# Altium project GPS_Traking_V1_1.PrjPcb
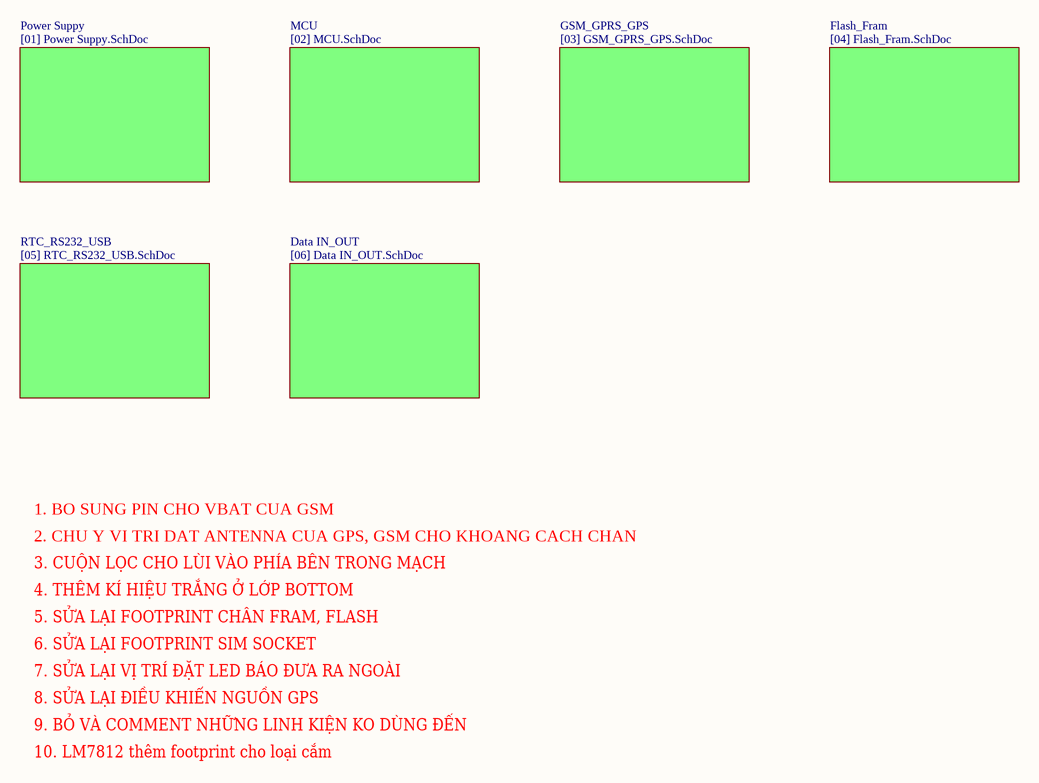
[diagram p0: GPS_Traking_V1_1.SchDoc]
7 sheets, 166 parts. Net scope: flat (ports and power ports of the same name join across sheets).
Board file: GPS_Traking_V1_1.PcbDoc
Sheets:
  GPS_Traking_V1_1.SchDoc
    Power Suppy = [01] Power Suppy.SchDoc
    MCU = [02] MCU.SchDoc
    GSM_GPRS_GPS = [03] GSM_GPRS_GPS.SchDoc
    Flash_Fram = [04] Flash_Fram.SchDoc
    RTC_RS232_USB = [05] RTC_RS232_USB.SchDoc
    Data IN_OUT = [06] Data IN_OUT.SchDoc

## Sheet GPS_Traking_V1_1.SchDoc: GPS_Tracking
size A4

### Sub-sheets
Data IN_OUT = [06] Data IN_OUT.SchDoc: no entries
Flash_Fram = [04] Flash_Fram.SchDoc: no entries
GSM_GPRS_GPS = [03] GSM_GPRS_GPS.SchDoc: no entries
MCU = [02] MCU.SchDoc: no entries
Power Suppy = [01] Power Suppy.SchDoc: no entries
RTC_RS232_USB = [05] RTC_RS232_USB.SchDoc: no entries

### Notes on the sheet
- 1. BO SUNG PIN CHO VBAT CUA GSM
- 2. CHU Y VI TRI DAT ANTENNA CUA GPS, GSM CHO KHOANG CACH CHAN
- 3. CUỘN LỌC CHO LÙI VÀO PHÍA BÊN TRONG MẠCH
- 4. THÊM KÍ HIỆU TRẮNG Ở LỚP BOTTOM
- 5. SỬA LẠI FOOTPRINT CHÂN FRAM, FLASH
- 6. SỬA LẠI FOOTPRINT SIM SOCKET
- 7. SỬA LẠI VỊ TRÍ ĐẶT LED BÁO ĐƯA RA NGOÀI
- 8. SỬA LẠI ĐIỀU KHIỂN NGUỒN GPS
- 9. BỎ VÀ COMMENT NHỮNG LINH KIỆN KO DÙNG ĐẾN
- 10. LM7812 thêm footprint cho loại cắm
- Title
- Size:
- Date:
- A4
- Number:
- Time:
- Revision:
- Sheet
- of
- File:

## Sheet [01] Power Suppy.SchDoc: Power Supply
size A4
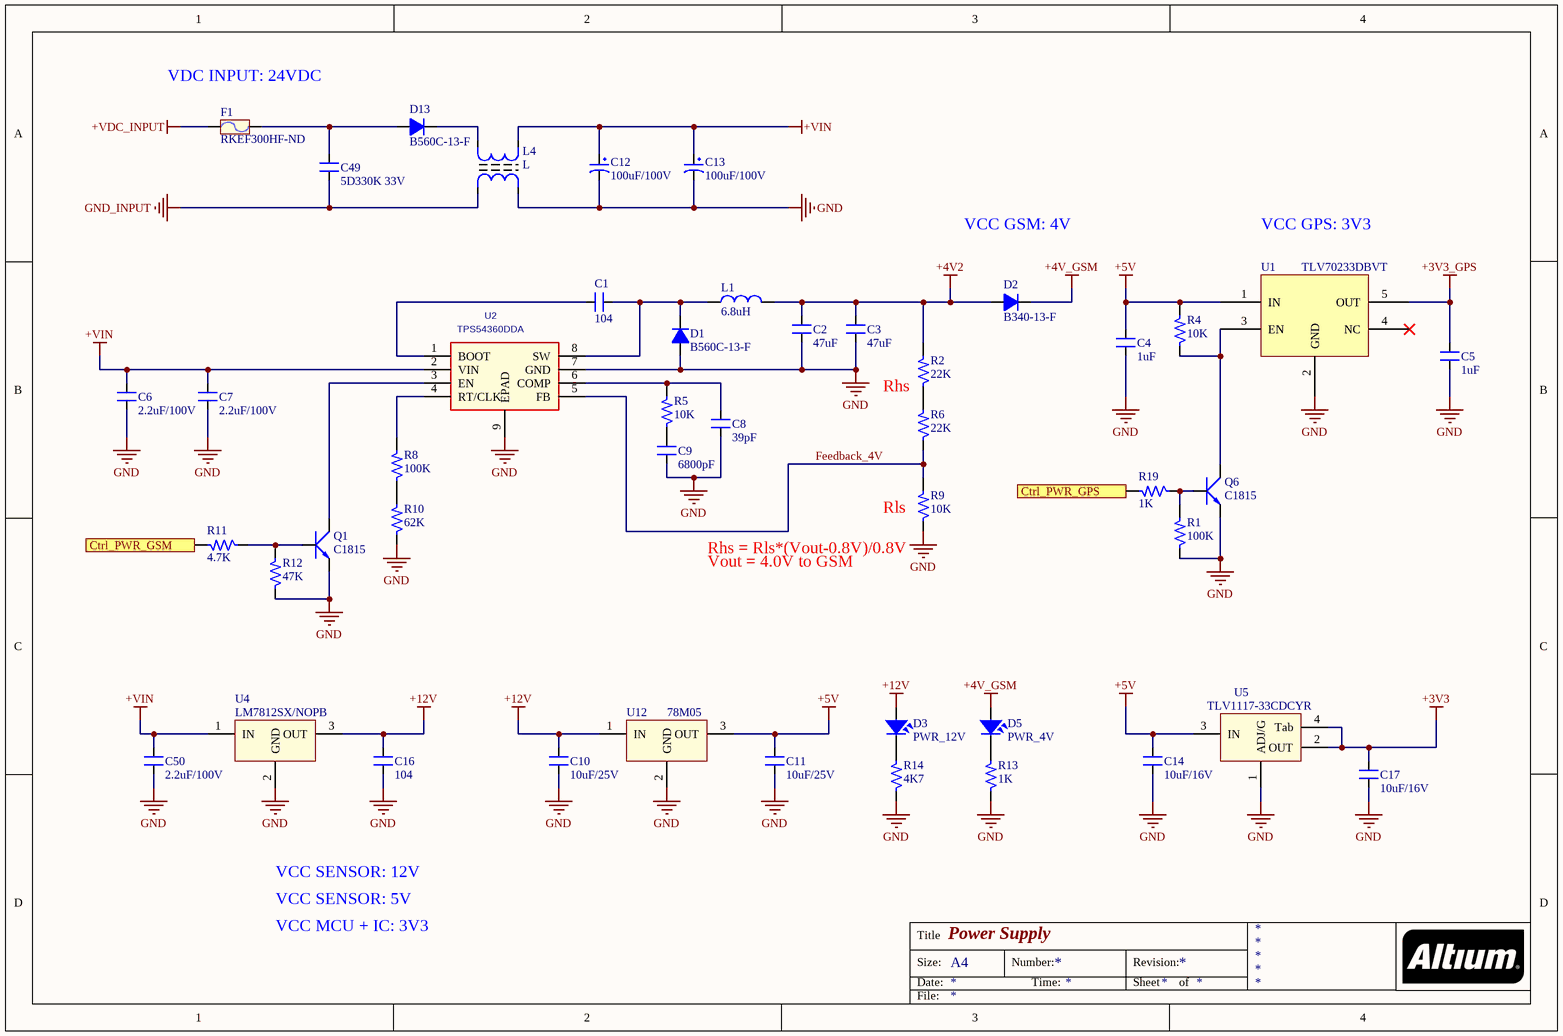
[diagram p1: [01] Power Suppy.SchDoc]

### Parts
C1  104  [C0603 SMT]
C2  47uF  [SM-1210]
C3  47uF  [SM-1210]
C4  1uF  [C0603 SMT]
C5  1uF  [C0603 SMT]
C6  2.2uF/100V  [SM-1210]
C7  2.2uF/100V  [SM-1210]
C8  39pF  [C0603 SMT]
C9  6800pF  [C0603 SMT]
C10  10uF/25V  [C0603 SMT]
C11  10uF/25V  [C0603 SMT]
C12  100uF/100V  [CP1.5/3.4]
C13  100uF/100V  [CP1.5/3.4]
C14  10uF/16V  [C0603 SMT]
C16  104  [C0603 SMT]
C17  10uF/16V  [C0603 SMT]
C49  5D330K 33V  [CN2]
C50  2.2uF/100V  [SM-1210]
D1  B560C-13-F  [DO-214AB SMC]
D2  B340-13-F  [DO-214AB SMA]
D3  PWR_12V  [Led_0603_Yellow]
D5  PWR_4V  [Led_0603_Green]
D13  B560C-13-F  [DO-214AB SMC]
F1  RKEF300HF-ND  [FUSE2]
L1  6.8uH  [L01 SMD 12*12*6]
L4  L  [L2 UF9.8]
Q1  C1815  [SOT23B]
Q6  C1815  [SOT23B]
R1  100K  [R0603 -SMT]
R2  22K  [R0603 -SMT]
R4  10K  [R0603 -SMT]
R5  10K  [R0603 -SMT]
R6  22K  [R0603 -SMT]
R8  100K  [R0603 -SMT]
R9  10K  [R0603 -SMT]
R10  62K  [R0603 -SMT]
R11  4.7K  [R0603 -SMT]
R12  47K  [R0603 -SMT]
R13  1K  [R0603 -SMT]
R14  4K7  [R0603 -SMT]
R19  1K  [R0603 -SMT]
U1  TLV70233DBVT  [TLV70233_3.3V]
U2  TPS54360DDA  [DDA8_3P1X2P4-M]
U4  LM7812SX/NOPB  [TO-263-4]
U5  TLV1117-33CDCYR  [SOT223-4N]
U12  78M05  [TO252-3L]

### Ports
Ctrl_PWR_GPS, Ctrl_PWR_GSM

### Nets
+3V3: C17.2 U5.2(OUT) U5.4(Tab)
+3V3_GPS: C5.2 U1.5(OUT)
+4V2: C2.2 C3.2 D2.1(A) L1.2 R2.2
+4V_GSM: D2.2(K) D5.1
+5V: C4.2 C11.2 C14.2 R4.2 U1.1(IN) U5.3(IN) U12.3(OUT)
+12V: C10.2 C16.2 D3.1 U4.3(OUT) U12.1(IN)
+VDC_INPUT: F1.1
+VIN: C6.2 C7.2 C12.1 C13.1 C50.2 L4.3 U2.2(VIN) U4.1(IN)
GND: C2.1 C3.1 C4.1 C5.1 C6.1 C7.1 C8.1 C9.1 C10.1 C11.1 C12.2 C13.2 C14.1 C16.1 C17.1 C50.1 D1.1(A) L4.2 Q1.1(E) Q6.1(E) R1.1 R9.1 R10.1 R12.1 R13.1 R14.1 U1.2(GND) U2.7(GND) U2.9(EPAD) U4.2(GND) U5.1(ADJ/G) U12.2(GND)
GND_INPUT: C49.1 L4.1
Feedback_4V: R6.1 R9.2 U2.5(FB)
NetC1_1: C1.1 U2.1(BOOT)
NetC1_2: C1.2 D1.2(K) L1.1 U2.8(SW)
NetC8_2: C8.2 R5.2 U2.6(COMP)
NetC9_2: C9.2 R5.1
NetC49_2: C49.2 D13.1(A) F1.2
NetD3_2: D3.2 R14.2
NetD5_2: D5.2 R13.2
NetD13_2: D13.2(K) L4.4
NetQ1_2: Q1.2(C) U2.3(EN)
NetQ1_3: Q1.3(B) R11.1 R12.2
NetQ6_2: Q6.2(C) R4.1 U1.3(EN)
NetQ6_3: Q6.3(B) R1.2 R19.1
NetR2_1: R2.1 R6.2
NetR8_1: R8.1 R10.2
NetR8_2: R8.2 U2.4(RT/CLK)
NetR11_2: R11.2 ; port Ctrl_PWR_GSM
NetR19_2: R19.2 ; port Ctrl_PWR_GPS

Not connected (* = marked no-connect by the designer): U1 4(NC)*

### Notes on the sheet
- (near F1) VDC INPUT: 24VDC
- VCC GSM: 4V
- VCC GPS: 3V3
- Rhs
- (near R9) Rls
- (near R9) Rhs = Rls*(Vout-0.8V)/0.8V
- Vout = 4.0V to GSM
- VCC SENSOR: 12V
- VCC SENSOR: 5V
- VCC MCU + IC: 3V3
- Title
- Size:
- Date:
- A4
- Number:
- Time:
- Revision:
- Sheet
- of
- File:

### Library data of the parts
C1 C4 C5 C8-C11 C14 C16 C17 = CM: Cap SMD; Value: 103
C2 = CM: CAP CER 47UF 10V X5R 1210; Value: 103
C3 = CM: CAP CER 47UF 10V X5R 1210 1276-3380-2-ND; Value: 103
C6 C7 C50 = CM: CAP CER 2.2UF 100V X7R 1210  445-4498-2-ND; Value: 103
C12 C13 = CP4: Cap 1000uF/16V - 220uF/50V; Description 5: 4,7uF>10uF/250V_3,3uF>10uF/400V - 2,2uF>4,7uF/450V; Description 1: 2200uF-3300uF/6,3V - 1000uF-2200uF/10V; Description 2: 1000uF/16V - 470uF => 1000uF/25V - 100uF/100V; Description 3: 330uF>470uF/35V_220uF>470uF/50V_10uF>22uF/250V; Description 4: 220uF => 330uF/63V - 10uF =>33uF/160 - 200V; Value: 1000uF/16V
C49 = CN: Value: 0,1uF/300V; Designed by: VanDungEvn
D1 D13 = D5A: DIODE SCHOTTKY 60V 5A SMC; Value: 1N5408
D2 = D1A: DIODE SCHOTTKY 40V 3A SMC; Value: 1N4007
D3 D5 = LED: LED Single colour Green and Red; Value: LED 3 ly Single Colour
F1 = Fuse: PTC RESET FUSE 60V 3A RADIAL; Designed by: VanDungEvn; Value: Fuse
L1 = L1: FIXED IND 6.2UH 5.7A 22.4 MOHM; Value: 150 mH
L4 = L2x220: Inductor; Value: Loc 220; Designed by: VanDungEvn
Q1 Q6 = C1815: NPN 600mW, ECB; Value: C1815
R1 R2 R4-R6 R8-R12 R14 = RM: Resistor SMD; Value: 1K
R13 R19 = RM: Resistor SMD; Value: 1K
U1 = TLV70233_3.3V
U2 = TPS54360DDA: REG BUCK SPLIT RAIL 8SOPWRPAD; C: Copyright (C) 2015 Accelerated Designs. All rights reserved; Vendor: TEXAS INSTRUMENTS; Built_By: EMA_UL_Team; Value: TPS54360DDA; Manufacturer_Part_Number: TPS54360DDA
U4 = LM78xx: Value: LM7805
U5 = LM1117: 3v3; Value: LM317
U12 = LM78xx: On ap +, from + 5 to + 24VDC; Value: LM7805

## Sheet [02] MCU.SchDoc: MCU
size A4
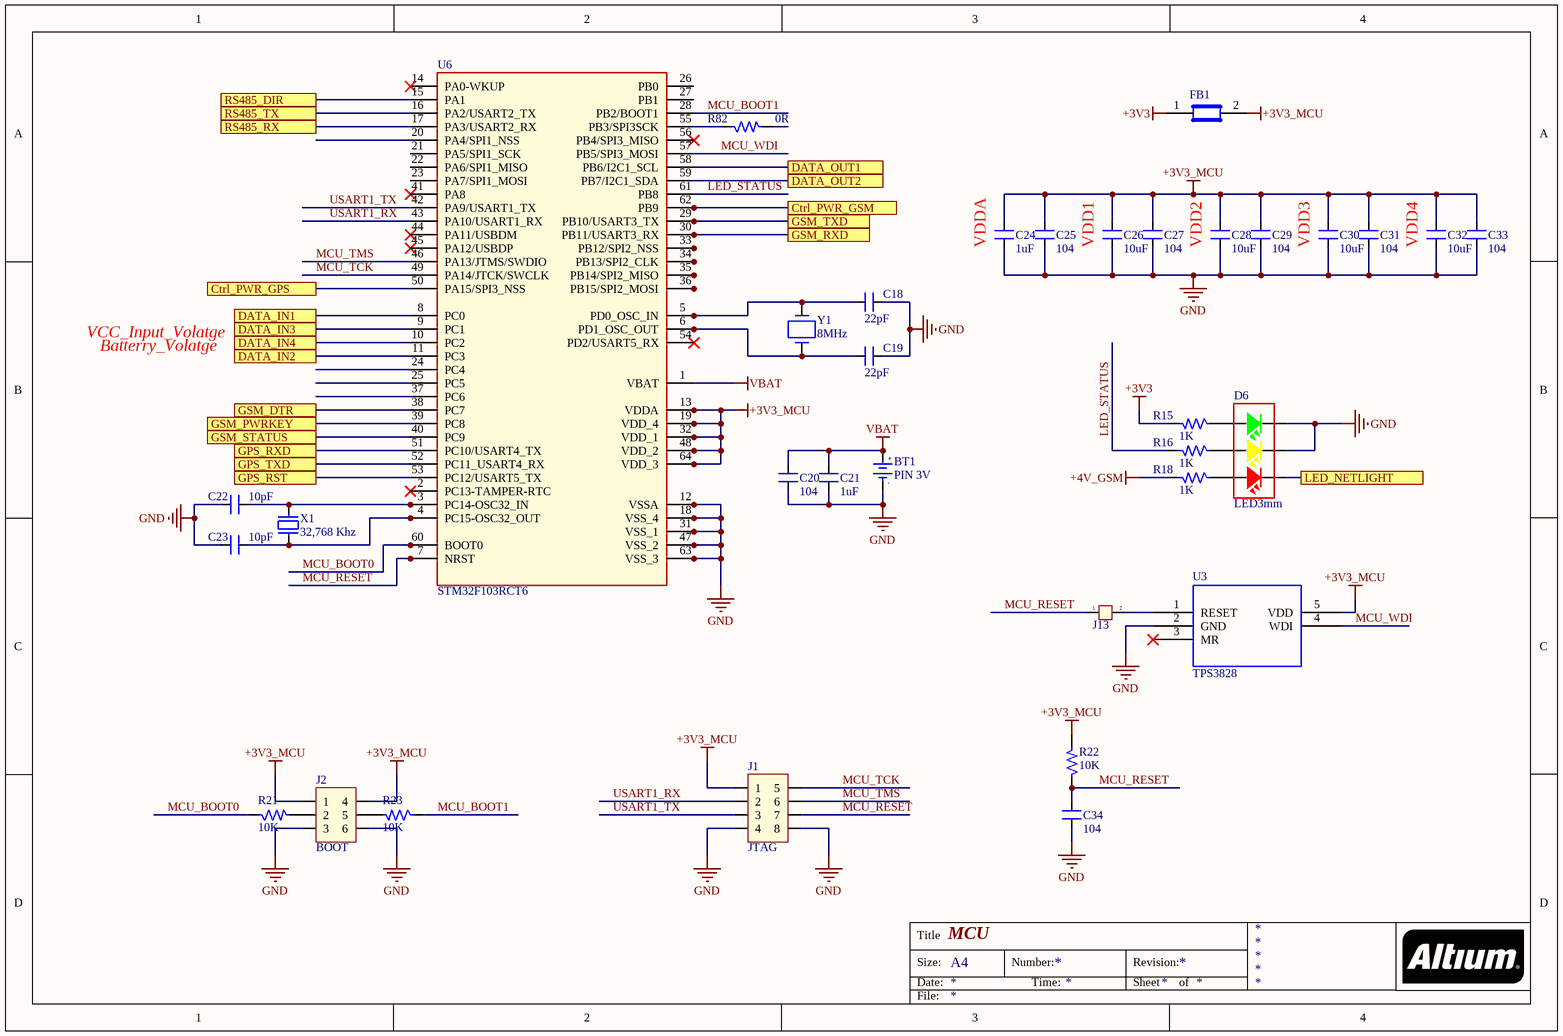
[diagram p2: [02] MCU.SchDoc]

### Parts
BT1  PIN 3V  [PIN3V_mini]
C18  22pF  [C0603 SMT]
C19  22pF  [C0603 SMT]
C20  104  [C0603 SMT]
C21  1uF  [C0603 SMT]
C22  10pF  [C0603 SMT]
C23  10pF  [C0603 SMT]
C24  1uF  [C0603 SMT]
C25  104  [C0603 SMT]
C26  10uF  [C0603 SMT]
C27  104  [C0603 SMT]
C28  10uF  [C0603 SMT]
C29  104  [C0603 SMT]
C30  10uF  [C0603 SMT]
C31  104  [C0603 SMT]
C32  10uF  [C0603 SMT]
C33  104  [C0603 SMT]
C34  104  [C0603 SMT]
D6  LED3mm  [LED 3 holder 3mm]
FB1  BLM21PG600SN1D  [R0805]  (value not drawn)
J1  JTAG  [JP4x2]
J2  BOOT  [JP3x2]
J13  watdog  [JP2]  (value not drawn)
R15  1K  [R0603 -SMT]
R16  1K  [R0603 -SMT]
R18  1K  [R0603 -SMT]
R21  10K  [R0603 -SMT]
R22  10K  [R0603 -SMT]
R23  10K  [R0603 -SMT]
R82  0R  [R0603 -SMT]
U3  TPS3828  [TPS3828]
U6  STM32F103RCT6  [LQFP-64]
X1  32,768 Khz  [XT32kn]
Y1  8MHz  [ABM7_v1_1_BIG]

### Ports
Ctrl_PWR_GPS, Ctrl_PWR_GSM, DATA_IN1, DATA_IN2, DATA_IN3, DATA_IN4, DATA_OUT1, DATA_OUT2, GPS_RST, GPS_RXD, GPS_TXD, GSM_DTR, GSM_PWRKEY, GSM_RXD, GSM_STATUS, GSM_TXD, LED_NETLIGHT, RS485_DIR, RS485_RX, RS485_TX

### Nets
+3V3: FB1.1 R15.2
+3V3_MCU: C24.2 C25.2 C26.2 C27.2 C28.2 C29.2 C30.2 C31.2 C32.2 C33.2 FB1.2 J1.1 J2.1 J2.4 R22.2 U3.5(VDD) U6.13(VDDA) U6.19(VDD_4) U6.32(VDD_1) U6.48(VDD_2) U6.64(VDD_3)
+4V_GSM: R18.2
GND: BT1.2(GND) C18.2 C19.2 C20.1 C21.1 C22.2 C23.2 C24.1 C25.1 C26.1 C27.1 C28.1 C29.1 C30.1 C31.1 C32.1 C33.1 C34.2 D6.3 D6.5 J1.4 J1.8 J2.3 J2.6 U3.2(GND) U6.12(VSSA) U6.18(VSS_4) U6.31(VSS_1) U6.47(VSS_2) U6.63(VSS_3)
VBAT: BT1.1(+3V) C20.2 C21.2 U6.1(VBAT)
LED_STATUS: R16.2 U6.61(PB8)
MCU_BOOT0: R21.1 U6.60(BOOT0)
MCU_BOOT1: R23.1 U6.28(PB2/BOOT1)
MCU_RESET: C34.1 J1.7 J13.1 R22.1 U6.7(NRST)
MCU_TCK: J1.5 U6.49(PA14/JTCK/SWCLK)
MCU_TMS: J1.6 U6.46(PA13/JTMS/SWDIO)
MCU_WDI: U3.4(WDI) U6.57(PB5/SPI3_MOSI)
RS485_DIR: U6.15(PA1) ; port RS485_DIR
RS485_RX: U6.17(PA3/USART2_RX) ; port RS485_RX
RS485_TX: U6.16(PA2/USART2_TX) ; port RS485_TX
USART1_RX: J1.2 U6.43(PA10/USART1_RX)
USART1_TX: J1.3 U6.42(PA9/USART1_TX)
NetC18_1: C18.1 U6.5(PD0_OSC_IN) Y1.2
NetC19_1: C19.1 U6.6(PD1_OSC_OUT) Y1.1
NetC22_1: C22.1 U6.3(PC14-OSC32_IN) X1.1
NetC23_1: C23.1 U6.4(PC15-OSC32_OUT) X1.2
NetD6_1: D6.1 ; port LED_NETLIGHT
NetD6_2: D6.2 R18.1
NetD6_4: D6.4 R16.1
NetD6_6: D6.6 R15.1
NetJ2_2: J2.2 R21.2
NetJ2_5: J2.5 R23.2
NetJ13_2: J13.2 U3.1(RESET)
NetR11_2: U6.62(PB9) ; port Ctrl_PWR_GSM
NetR19_2: U6.50(PA15/SPI3_NSS) ; port Ctrl_PWR_GPS
NetR24_1: U6.39(PC8) ; port GSM_PWRKEY
NetR26_1: U6.38(PC7) ; port GSM_DTR
NetR28_1: U6.30(PB11/USART3_RX) ; port GSM_RXD
NetR29_1: U6.29(PB10/USART3_TX) ; port GSM_TXD
NetR33_1: U6.53(PC12/USART5_TX) ; port GPS_RST
NetR39_2: U6.40(PC9) ; port GSM_STATUS
NetR65_1: U6.8(PC0) ; port DATA_IN1
NetR67_1: U6.58(PB6/I2C1_SCL) ; port DATA_OUT1
NetR68_1: U6.59(PB7/I2C1_SDA) ; port DATA_OUT2
NetR69_1: U6.11(PC3) ; port DATA_IN2
NetR71_1: U6.9(PC1) ; port DATA_IN3
NetR73_1: U6.10(PC2) ; port DATA_IN4
NetR82_1: R82.1 U6.55(PB3/SPI3SCK)
NetU6_51: U6.51(PC10/USART4_TX) ; port GPS_RXD
NetU6_52: U6.52(PC11_USART4_RX) ; port GPS_TXD

Not connected (* = marked no-connect by the designer): R82 2; U3 3(MR)*; U6 2(PC13-TAMPER-RTC)* 14(PA0-WKUP)* 20(PA4/SPI1_NSS) 21(PA5/SPI1_SCK) 22(PA6/SPI1_MISO) 23(PA7/SPI1_MOSI) 24(PC4) 25(PC5) 26(PB0) 27(PB1) 33(PB12/SPI2_NSS) 34(PB13/SPI2_CLK) 35(PB14/SPI2_MISO) 36(PB15/SPI2_MOSI) 37(PC6) 41(PA8)* 44(PA11/USBDM)* 45(PA12/USBDP)* 54(PD2/USART5_RX)* 56(PB4/SPI3_MISO)*

### Notes on the sheet
- (near C24) VDDA
- (near C26) VDD1
- (near C28) VDD2
- (near C30) VDD3
- (near C32) VDD4
- VCC_Input_Volatge
- Batterry_Volatge
- Title
- Size:
- Date:
- A4
- Number:
- Time:
- Revision:
- Sheet
- of
- File:
- (in symbol PIN 3V) +; -

### Library data of the parts
BT1 = PIN 3V: Battery 3VDC; Value: PIN 3V
C18-C34 = CM: Cap SMD; Value: 103
D6 = LED3Holder_3: LED 3 holder RGB 3mm; Value: LED 3 ly Single Colour
FB1 = Ferrite Bead
J1 = JP4x2: Connector 4x2; Value: Connector 4x2
J2 = JP3x2: Connector 3x2; Value: Connector 3x2
J13 = JP 2: Jumper 2; Value: JP 2
R15 R16 R18 = RM: Resistor SMD; Value: 1K
R21-R23 R82 = RM: Resistor SMD; Value: 1K
U6 = STM32F103RCT6: MCU 32BIT 256KB FLASH 64LQFP
X1 = XT32k: Crystal 32,768kHz for timer real; Value: 32,768khz
Y1 = ABM7-16.000MHZ-D2Y-T: CRYSTAL 16MHZ 18PF SMD; Manufacturer: Abracon LLC; Frequency Stability: ±30ppm; Frequency Tolerance: ±20ppm; ESR (Equivalent Series Resistance): 50 Ohm; Operating Mode: Fundamental; .Creator: MM; .Checked PCB: RF; Supplier 1: Digi-Key; Manufacturer Part Number: ABM7-16.000MHZ-D2Y-T; RoHS: RoHS Compliant; Category: Crystals and Oscillators; Stock 1: 5861; Pricing 1: 1=0.96, 10=0.847, 50=0.791, 100=0.7, 500=0.6615 (USD); Packaging: Cut Tape (CT); Type: MHz Crystal; Frequency: 16MHz; Load Capacitance: 18pF; Operating Temperature: -40°C ~ 85°C; Ratings: -; Mounting Type: Surface Mount; Package / Case: 2-SMD; Size / Dimension: 0.236" L x 0.138" W (6.00mm x 3.50mm); Height: 0.055" (1.40mm); ComponentLink1URL: http://www.abracon.com/Resonators/abm7.pdf; ComponentLink1Description: http://www.abracon.com/Resonators/abm7.pdf; Supplier Part Number 1: 535-9840-1-ND; .Checked SCH: RF

## Sheet [03] GSM_GPRS_GPS.SchDoc: GSM_GPRS_GPS
size A4
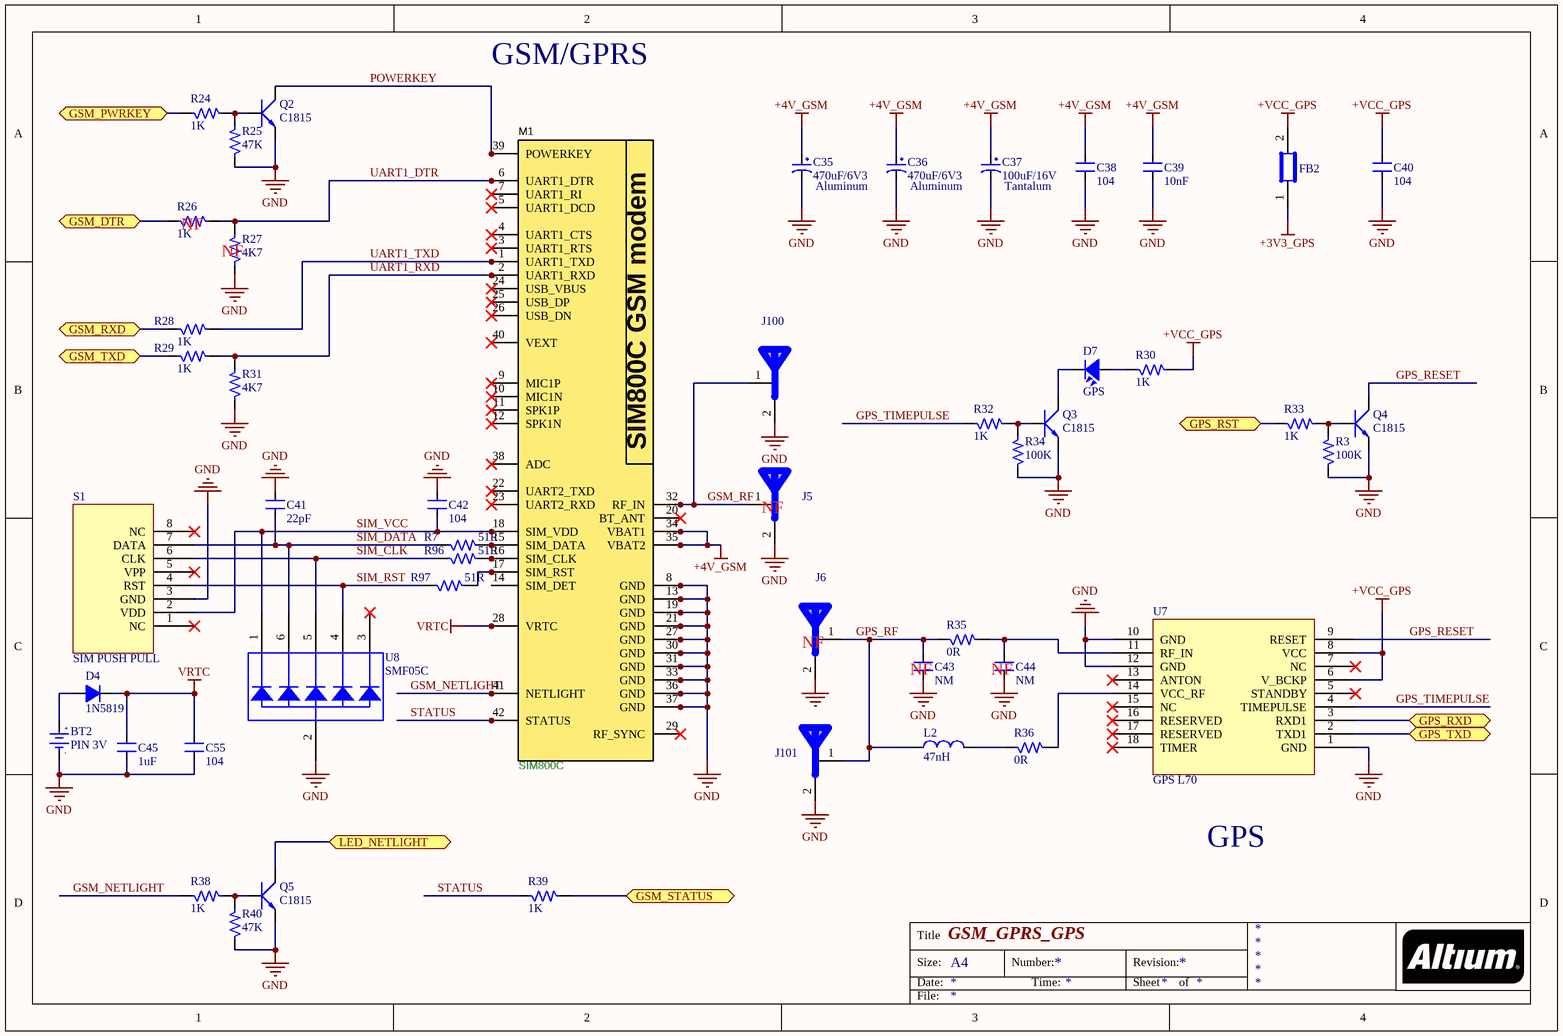
[diagram p3: [03] GSM_GPRS_GPS.SchDoc]

### Parts
BT2  PIN 3V  [PIN3V_mini]
C35  470uF/6V3  [C_Alu_6.3x7.7]
C36  470uF/6V3  [C_Alu_6.3x7.7]
C37  100uF/16V  [C_7343_40]
C38  104  [C0603 SMT]
C39  10nF  [C0603 SMT]
C40  104  [C0603 SMT]
C41  22pF  [C0603 SMT]
C42  104  [C0603 SMT]
C43  NM  [C0603 SMT]
C44  NM  [C0603 SMT]
C45  1uF  [C0603 SMT]
C55  104  [C0603 SMT]
D4  1N5819  [SOD123]
D7  GPS  [Led_0603_RED]
FB2  BLM21PG600SN1D  [R0805]  (value not drawn)
J5  GSM  [Antenna-IPEX]  (value not drawn)
J6  GPS  [Antenna-IPEX]  (value not drawn)
J100  GPS_ANTENNA  [Antenna-MCX5.08-H5]  (value not drawn)
J101  GPS_ANTENNA  [Antenna-MCX5.08-H5]  (value not drawn)
L2  47nH  [C0805]
M1  SIM800C  [SIM800C]
Q2  C1815  [SOT23B]
Q3  C1815  [SOT23B]
Q4  C1815  [SOT23B]
Q5  C1815  [SOT23B]
R3  100K  [R0603 -SMT]
R7  51R  [R0603 -SMT]
R24  1K  [R0603 -SMT]
R25  47K  [R0603 -SMT]
R26  1K  [R0603 -SMT]
R27  4K7  [R0603 -SMT]
R28  1K  [R0603 -SMT]
R29  1K  [R0603 -SMT]
R30  1K  [R0603 -SMT]
R31  4K7  [R0603 -SMT]
R32  1K  [R0603 -SMT]
R33  1K  [R0603 -SMT]
R34  100K  [R0603 -SMT]
R35  0R  [R0603 -SMT]
R36  0R  [R0603 -SMT]
R38  1K  [R0603 -SMT]
R39  1K  [R0603 -SMT]
R40  47K  [R0603 -SMT]
R96  51R  [R0603 -SMT]
R97  51R  [R0603 -SMT]
S1  SIM PUSH PULL  [Sim Push Push]
U7  GPS L70  [GPS L70]
U8  SMF05C  [SOT_363_6]

### Ports
GPS_RST, GPS_RXD, GPS_TXD, GSM_DTR, GSM_PWRKEY, GSM_RXD, GSM_STATUS, GSM_TXD, LED_NETLIGHT

### Nets
+3V3_GPS: FB2.1
+4V_GSM: C35.1 C36.1 C37.1 C38.1 C39.1 M1.34(VBAT1) M1.35(VBAT2)
+VCC_GPS: C40.2 FB2.2 R30.2 U7.6(V_BCKP) U7.8(VCC)
GND: BT2.2(GND) C35.2 C36.2 C37.2 C38.2 C39.2 C40.1 C41.2 C42.2 C43.1 C44.1 C45.1 C55.1 J5.2(GND) J6.2(GND) J100.2(GND) J101.2(GND) M1.8(GND) M1.13(GND) M1.19(GND) M1.21(GND) M1.27(GND) M1.30(GND) M1.31(GND) M1.33(GND) M1.36(GND) M1.37(GND) Q2.1(E) Q3.1(E) Q4.1(E) Q5.1(E) R3.1 R25.1 R27.1 R31.1 R34.1 R40.1 S1.3(GND) U7.1(GND) U7.10(GND) U7.12(GND) U8.2(A)
VRTC: C45.2 C55.2 D4.2(K) M1.28(VRTC)
GPS_RESET: Q4.2(C) U7.9(RESET)
GPS_RF: C43.2 J6.1(GND) J101.1(GND) L2.1 R35.1
GPS_TIMEPULSE: R32.1 U7.4(TIMEPULSE)
GSM_NETLIGHT: M1.41(NETLIGHT) R38.1
GSM_RF: J5.1(GND) J100.1(GND) M1.32(RF_IN)
POWERKEY: M1.39(POWERKEY) Q2.2(C)
SIM_CLK: R96.1 S1.6(CLK) U8.5(K4)
SIM_DATA: C41.1 R7.1 S1.7(DATA) U8.6(K5)
SIM_RST: R97.1 S1.4(RST) U8.4(K3)
SIM_VCC: C42.1 M1.18(SIM_VDD) S1.2(VDD) U8.1(K1)
STATUS: M1.42(STATUS) R39.1
UART1_DTR: M1.6(UART1_DTR) R26.2 R27.2
UART1_RXD: M1.2(UART1_RXD) R29.2 R31.2
UART1_TXD: M1.1(UART1_TXD) R28.2
NetBT2_1: BT2.1(+3V) D4.1(A)
NetC44_2: C44.2 R35.2 U7.11(RF_IN)
NetD6_1: Q5.2(C) ; port LED_NETLIGHT
NetD7_1: D7.1 R30.1
NetD7_2: D7.2 Q3.2(C)
NetL2_2: L2.2 R36.1
NetM1_15: M1.15(SIM_DATA) R7.2
NetM1_16: M1.16(SIM_CLK) R96.2
NetM1_17: M1.17(SIM_RST) R97.2
NetQ2_3: Q2.3(B) R24.2 R25.2
NetQ3_3: Q3.3(B) R32.2 R34.2
NetQ4_3: Q4.3(B) R3.2 R33.2
NetQ5_3: Q5.3(B) R38.2 R40.2
NetR24_1: R24.1 ; port GSM_PWRKEY
NetR26_1: R26.1 ; port GSM_DTR
NetR28_1: R28.1 ; port GSM_RXD
NetR29_1: R29.1 ; port GSM_TXD
NetR33_1: R33.1 ; port GPS_RST
NetR36_2: R36.2 U7.14(VCC_RF)
NetR39_2: R39.2 ; port GSM_STATUS
NetU6_51: U7.3(RXD1) ; port GPS_RXD
NetU6_52: U7.2(TXD1) ; port GPS_TXD

Not connected (* = marked no-connect by the designer): M1 3(UART1_RTS)* 4(UART1_CTS)* 5(UART1_DCD)* 7(UART1_RI)* 9(MIC1P)* 10(MIC1N)* 11(SPK1P)* 12(SPK1N)* 14(SIM_DET) 20(BT_ANT)* 22(UART2_TXD)* 23(UART2_RXD)* 24(USB_VBUS)* 25(USB_DP)* 26(USB_DN)* 29(RF_SYNC)* 38(ADC)* 40(VEXT)*; S1 1(NC)* 5(VPP)* 8(NC)*; U7 5(STANDBY)* 7(NC)* 13(ANTON)* 15(NC)* 16(RESERVED)* 17(RESERVED)* 18(TIMER)*; U8 3(K2)*

### Notes on the sheet
- GSM/GPRS
- (near R26) NF
- (near C35) Aluminum
- (near C36) Aluminum
- (near C37) Tantalum
- (near R27) NF
- (near J5) NF
- (near J6) NF
- (near C43) NF
- (near C44) NF
- GPS
- Title
- Size:
- Date:
- A4
- Number:
- Time:
- Revision:
- Sheet
- of
- File:
- (in symbol PIN 3V) +; -
- (in symbol SIM800C) SIM800C GSM modem

### Library data of the parts
BT2 = PIN 3V: Battery 3VDC; Value: PIN 3V
C35 C36 = C-Alu-Tantalum: Cap Aluminum; Value: 10uF/50V; Description 1: 10 => 220uF/6,3V/10V - 10uF => 100uF/16V; Description 2: 0,1uF => 33uF/50V - 10uF => 22uF/63V; Description 3: 0,47uF => 10uF/100V
C37 = C-Alu-Tantalum: Cap Tantalum 7343; Value: 10uF/50V; Description 1: 10 => 220uF/6,3V/10V - 10uF => 100uF/16V; Description 2: 0,1uF => 33uF/50V - 10uF => 22uF/63V; Description 3: 0,47uF => 10uF/100V
C38-C45 C55 = CM: Cap SMD; Value: 103
D4 = D1A: Diode 1A; Value: 1N4007
D7 = LED: as D3 on sheet [01] Power Suppy
FB2 = Ferrite Bead
J5 J6 J100 J101 = ANTEN
L2 = L1: Inductor; Value: 150 mH
Q2-Q5 = C1815: NPN 600mW, ECB; Value: C1815
R3 R7 R25 R27 R31 R34-R36 R40 R96 R97 = RM: Resistor SMD; Value: 1K
R24 R26 R28-R30 R32 R33 R38 R39 = RM: Resistor SMD; Value: 1K
S1 = SIM SOCKET PUSH PULL
U8 = SMF05C: ESD Protection

## Sheet [04] Flash_Fram.SchDoc: Flash_Fram
size A4

### Notes on the sheet
- Title
- Size:
- Date:
- A4
- Number:
- Time:
- Revision:
- Sheet
- of
- File:

## Sheet [05] RTC_RS232_USB.SchDoc: RTC_RS232_USB
size A4
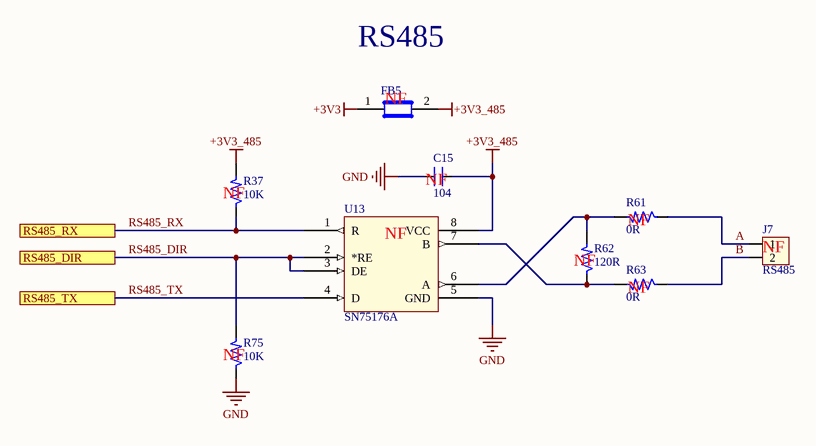
[diagram p4: [05] RTC_RS232_USB.SchDoc]

### Parts
C15  104  [C0603 SMT]
FB5  BLM21PG600SN1D  [R0805]  (value not drawn)
J7  RS485  [Hed2V_3.96]
R37  10K  [R0603 -SMT]
R61  0R  [R0603 -SMT]
R62  120R  [R0603 -SMT]
R63  0R  [R0603 -SMT]
R75  10K  [R0603 -SMT]
U13  SN75176A  [SN75176A]

### Ports
RS485_DIR, RS485_RX, RS485_TX

### Nets
+3V3: FB5.1
+3V3_485: C15.2 FB5.2 R37.2 U13.8(VCC)
GND: C15.1 R75.1 U13.5(GND)
A: J7.1 R61.1
B: J7.2 R63.1
RS485_DIR: R75.2 U13.2(*RE) U13.3(DE) ; port RS485_DIR
RS485_RX: R37.1 U13.1(R) ; port RS485_RX
RS485_TX: U13.4(D) ; port RS485_TX
NetR61_2: R61.2 R62.2 U13.6(A)
NetR62_1: R62.1 R63.2 U13.7(B)

### Notes on the sheet
- RS485
- (near FB5) NF
- (near C15) NF
- (near R37) NF
- (near U13) NF
- (near R61) NF
- (near J7) NF
- (near R62) NF
- (near R63) NF
- (near R75) NF
- Title
- Size:
- Date:
- A4
- Number:
- Time:
- Revision:
- Sheet
- of
- File:

### Library data of the parts
C15 = CM: Cap SMD; Value: 103
FB5 = Ferrite Bead
J7 = Hed2: Header 2 (Green); Value: Header 2
R37 R61-R63 R75 = RM: Resistor SMD; Value: 1K

## Sheet [06] Data IN_OUT.SchDoc: DATA INPUT OUTPUT
size A4
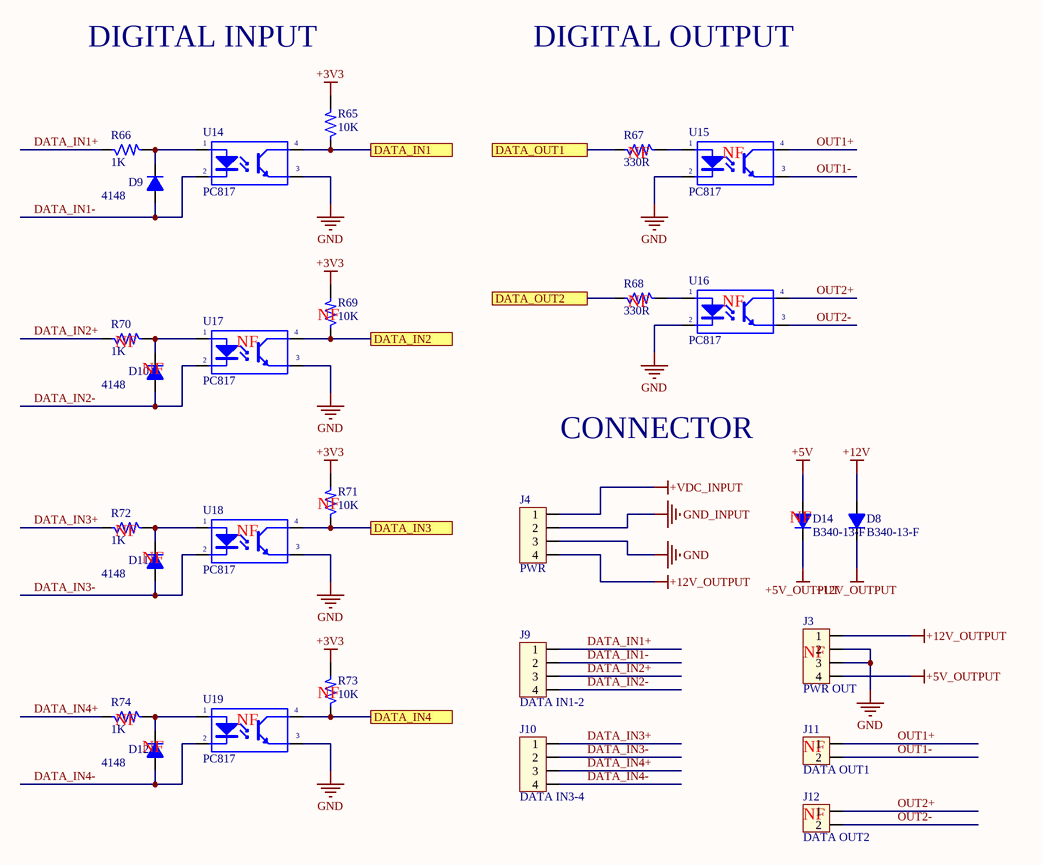
[diagram p5: [06] Data IN_OUT.SchDoc]

### Parts
D8  B340-13-F  [DO-214AB SMA]
D9  4148  [DO-4148 SMD]
D10  4148  [DO-4148 SMD]
D11  4148  [DO-4148 SMD]
D12  4148  [DO-4148 SMD]
D14  B340-13-F  [DO-214AB SMA]
J3  PWR OUT  [CON_2.54mm_4]
J4  PWR  [Hed4V_3.96]
J9  DATA IN1-2  [CON_2.54mm_4]
J10  DATA IN3-4  [CON_2.54mm_4]
J11  DATA OUT1  [CON_2.54mm_2]
J12  DATA OUT2  [CON_2.54mm_2]
R65  10K  [R0603 -SMT]
R66  1K  [R0603 -SMT]
R67  330R  [R0603 -SMT]
R68  330R  [R0603 -SMT]
R69  10K  [R0603 -SMT]
R70  1K  [R0603 -SMT]
R71  10K  [R0603 -SMT]
R72  1K  [R0603 -SMT]
R73  10K  [R0603 -SMT]
R74  1K  [R0603 -SMT]
U14  PC817  [DIP4/W0.3]
U15  PC817  [DIP4/W0.3]
U16  PC817  [DIP4/W0.3]
U17  PC817  [DIP4/W0.3]
U18  PC817  [DIP4/W0.3]
U19  PC817  [DIP4/W0.3]

### Ports
DATA_IN1, DATA_IN2, DATA_IN3, DATA_IN4, DATA_OUT1, DATA_OUT2

### Nets
+3V3: R65.2 R69.2 R71.2 R73.2
+5V: D14.1(A)
+5V_OUTPUT: D14.2(K) J3.4
+12V: D8.1(A)
+12V_OUTPUT: D8.2(K) J3.1 J4.4
+VDC_INPUT: J4.1
GND: J3.2 J3.3 J4.3 U14.3(E) U15.2(K) U16.2(K) U17.3(E) U18.3(E) U19.3(E)
GND_INPUT: J4.2
DATA_IN1+: J9.1 R66.1
DATA_IN1-: D9.1(A) J9.2 U14.2(K)
DATA_IN2+: J9.3 R70.1
DATA_IN2-: D10.1(A) J9.4 U17.2(K)
DATA_IN3+: J10.1 R72.1
DATA_IN3-: D11.1(A) J10.2 U18.2(K)
DATA_IN4+: J10.3 R74.1
DATA_IN4-: D12.1(A) J10.4 U19.2(K)
OUT1+: J11.1 U15.4(C)
OUT1-: J11.2 U15.3(E)
OUT2+: J12.1 U16.4(C)
OUT2-: J12.2 U16.3(E)
NetD9_2: D9.2(K) R66.2 U14.1(A)
NetD10_2: D10.2(K) R70.2 U17.1(A)
NetD11_2: D11.2(K) R72.2 U18.1(A)
NetD12_2: D12.2(K) R74.2 U19.1(A)
NetR65_1: R65.1 U14.4(C) ; port DATA_IN1
NetR67_1: R67.1 ; port DATA_OUT1
NetR67_2: R67.2 U15.1(A)
NetR68_1: R68.1 ; port DATA_OUT2
NetR68_2: R68.2 U16.1(A)
NetR69_1: R69.1 U17.4(C) ; port DATA_IN2
NetR71_1: R71.1 U18.4(C) ; port DATA_IN3
NetR73_1: R73.1 U19.4(C) ; port DATA_IN4

### Notes on the sheet
- DIGITAL INPUT
- DIGITAL OUTPUT
- (near R67) NF
- (near U15) NF
- (near R68) NF
- (near U16) NF
- (near R70) NF
- (near D10) NF
- (near U17) NF
- (near R69) NF
- CONNECTOR
- (near R71) NF
- (near R72) NF
- (near D11) NF
- (near U18) NF
- (near D14) NF
- (near R73) NF
- (near J3) NF
- (near R74) NF
- (near D12) NF
- (near U19) NF
- (near J11) NF
- (near J12) NF
- Title
- Size:
- Date:
- A4
- Number:
- Time:
- Revision:
- Sheet
- of
- File:

### Library data of the parts
D8-D12 D14 = D1A: Diode 1A; Value: 1N4007
J3 J9 J10 = Con4: Connector 4; Value: Connector 4
J4 = Hed4: Header 4 (Green); Value: Header 4
J11 J12 = Con2: Connector 2; Value: Connector 2
R65 R67-R69 R71 R73 = RM: Resistor SMD; Value: 1K
R66 R70 R72 R74 = RM: Resistor SMD; Value: 1K
U14-U19 = PC817: Single Opto; Value: PC817

## Nets that join several sheets
+3V3: [01] Power Suppy (C17.2 U5.2 U5.4), [02] MCU (FB1.1 R15.2), [05] RTC_RS232_USB (FB5.1), [06] Data IN_OUT (R65.2 R69.2 R71.2 R73.2)
+3V3_GPS: [01] Power Suppy (C5.2 U1.5), [03] GSM_GPRS_GPS (FB2.1)
+4V_GSM: [01] Power Suppy (D2.2 D5.1), [02] MCU (R18.2), [03] GSM_GPRS_GPS (7 pins)
+5V: [01] Power Suppy (7 pins), [06] Data IN_OUT (D14.1)
+12V: [01] Power Suppy (5 pins), [06] Data IN_OUT (D8.1)
+VDC_INPUT: [01] Power Suppy (F1.1), [06] Data IN_OUT (J4.1)
GND: [01] Power Suppy (32 pins), [02] MCU (30 pins), [03] GSM_GPRS_GPS (42 pins), [05] RTC_RS232_USB (C15.1 R75.1 U13.5), [06] Data IN_OUT (9 pins)
GND_INPUT: [01] Power Suppy (C49.1 L4.1), [06] Data IN_OUT (J4.2)
NetD6_1: [02] MCU (D6.1), [03] GSM_GPRS_GPS (Q5.2)
NetR11_2: [01] Power Suppy (R11.2), [02] MCU (U6.62)
NetR19_2: [01] Power Suppy (R19.2), [02] MCU (U6.50)
NetR24_1: [02] MCU (U6.39), [03] GSM_GPRS_GPS (R24.1)
NetR26_1: [02] MCU (U6.38), [03] GSM_GPRS_GPS (R26.1)
NetR28_1: [02] MCU (U6.30), [03] GSM_GPRS_GPS (R28.1)
NetR29_1: [02] MCU (U6.29), [03] GSM_GPRS_GPS (R29.1)
NetR33_1: [02] MCU (U6.53), [03] GSM_GPRS_GPS (R33.1)
NetR39_2: [02] MCU (U6.40), [03] GSM_GPRS_GPS (R39.2)
NetR65_1: [02] MCU (U6.8), [06] Data IN_OUT (R65.1 U14.4)
NetR67_1: [02] MCU (U6.58), [06] Data IN_OUT (R67.1)
NetR68_1: [02] MCU (U6.59), [06] Data IN_OUT (R68.1)
NetR69_1: [02] MCU (U6.11), [06] Data IN_OUT (R69.1 U17.4)
NetR71_1: [02] MCU (U6.9), [06] Data IN_OUT (R71.1 U18.4)
NetR73_1: [02] MCU (U6.10), [06] Data IN_OUT (R73.1 U19.4)
NetU6_51: [02] MCU (U6.51), [03] GSM_GPRS_GPS (U7.3)
NetU6_52: [02] MCU (U6.52), [03] GSM_GPRS_GPS (U7.2)
RS485_DIR: [02] MCU (U6.15), [05] RTC_RS232_USB (R75.2 U13.2 U13.3)
RS485_RX: [02] MCU (U6.17), [05] RTC_RS232_USB (R37.1 U13.1)
RS485_TX: [02] MCU (U6.16), [05] RTC_RS232_USB (U13.4)